# EAGLE design usb-rj45-serial-dongle (EAGLE 9.5.1)
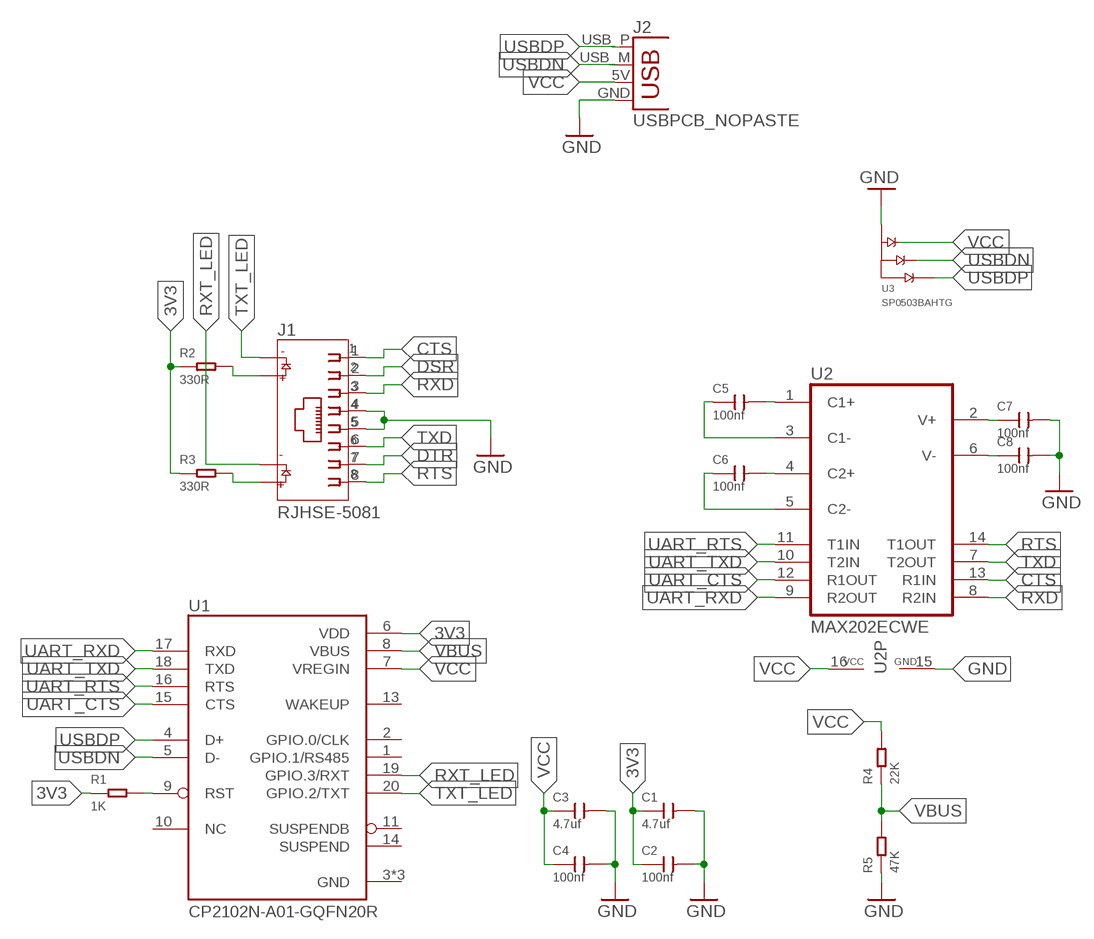
[diagram p0: schematic, sheet 1]

## Parts
C1  4.7uf  CERAMIC-4.7UF-6.3V-20%-X5R(0402)  [C0402]
C2  100nf  CERAMIC-100NF-25V-10%-X7R(0402)  [C0402]
C3  4.7uf  CERAMIC-4.7UF-6.3V-20%-X5R(0402)  [C0402]
C4  100nf  CERAMIC-100NF-25V-10%-X7R(0402)  [C0402]
C5  100nf  CERAMIC-100NF-25V-10%-X7R(0402)  [C0402]
C6  100nf  CERAMIC-100NF-25V-10%-X7R(0402)  [C0402]
C7  100nf  CERAMIC-100NF-25V-10%-X7R(0402)  [C0402]
C8  100nf  CERAMIC-100NF-25V-10%-X7R(0402)  [C0402]
J1  RJHSE-5081  [RJHSE-5081]
J2  USBPCB_NOPASTE  [USB-A-PCB-NOPASTE]
R1  1K  SMD-RES-1K-5%-1/16W(0402)  [R0402]
R2  330R  SMD-RES-330R-1%-1/16W(0402)  [R0402]
R3  330R  SMD-RES-330R-1%-1/16W(0402)  [R0402]
R4  22K  SMD-RES-22R-1%-1/16W(0402)  [R0402]
R5  47K  SMD-RES-47K-5%-1/16W(0402)  [R0402]
U1  CP2102N-A01-GQFN20R  [SILABS_QFN20]
U2  MAX202ECWE  [SO16L]
U3  SP0503BAHTG  [SOT143]

## Nets
3V3 [Supply]: C1.1 C2.1 R1.1 R2.1 R3.1 U1.6(VDD)
CTS: J1.1 U2.13(R1IN)
DSR: J1.2
DTR: J1.7
GND [Supply]: C1.2 C2.2 C3.2 C4.2 C7.2 C8.2 J1.4 J1.5 J2.GND R5.1 U2.15(GND) U3.1(GND)
N$1: C5.2 U2.1(C1+)
N$2: R1.2 U1.9(RST)
N$3: J1.12 R3.2
N$4: C6.2 U2.4(C2+)
N$5: J1.10 R2.2
N$6: C5.1 U2.3(C1-)
N$7: C6.1 U2.5(C2-)
N$8: C7.1 U2.2(V+)
N$9: C8.1 U2.6(V-)
RTS: J1.8 U2.14(T1OUT)
RXD: J1.3 U2.8(R2IN)
RXT_LED: J1.11 U1.19(GPIO.3/RXT)
TXD: J1.6 U2.7(T2OUT)
TXT_LED: J1.9 U1.20(GPIO.2/TXT)
UART_CTS: U1.15(CTS) U2.12(R1OUT)
UART_RTS: U1.16(RTS) U2.11(T1IN)
UART_RXD: U1.17(RXD) U2.9(R2OUT)
UART_TXD: U1.18(TXD) U2.10(T2IN)
USBDN: J2.USB_M(D-) U1.5(D-) U3.3(B)
USBDP: J2.USB_P(D+) U1.4(D+) U3.4(C)
VBUS: R4.1 R5.2 U1.8(VBUS)
VCC: C3.1 C4.1 J2.5V(VBUS) R4.2 U1.7(VREGIN) U2.16(VCC) U3.2(A)
Unconnected: U1.1(GPIO.1/RS485) U1.2(GPIO.0/CLK) U1.10(NC) U1.11(SUSPENDB) U1.13(WAKEUP) U1.14(SUSPEND)

## Power pins joined to a net without a drawn wire
GND: U1.3(GND) U1.12(GND) U1.21(GND)

## Library data of the parts
C1 C3 = OPL_Capacitor:CERAMIC-4.7UF-6.3V-20%-X5R(0402): 302010019; MPN: CC0402MRX5R5BB475
C2 C4-C8 = OPL_Capacitor:CERAMIC-100NF-25V-10%-X7R(0402): 302010024; MPN: CC0402KRX7R8BB104
J1 = RJHSE-5081:RJHSE-5081: connector, mod jack, rt angle pcb, shielded, led1-g, led2-y, single port, rj-45 8 cont; AVAILABILITY: Unavailable; DESCRIPTION: connector, mod jack, rt angle pcb, shielded, led1-g, led2-y, single port, rj-45 8 cont; MF: Amphenol ICC; MP: RJHSE-5381; PACKAGE: None; PRICE: None
J2 = SparkFun-Connectors:USB: USB Connectors USB-B-PTH is fully proven SKU : PRT-00139/CONN-08278 USB-miniB is fully proven SKU : PRT-00587 USB-A-PCB is untested. USB-A-H is throughly reviewed, but untested. Spark Fun Electronics SKU : PRT-00437 USB-B-SMT is throughly reviewed, but untested. Needs silkscreen touching up. USB-A-S has not been used/tested USB-MB-H has not been used/tested USB-MICROB has been used. CONN-09505
R1 = OPL_Resistor:SMD-RES-1K-5%-1/16W(0402): 301012016; MPN: RC0402JR-071KL
R2 R3 = OPL_Resistor:SMD-RES-330R-1%-1/16W(0402): 301011998; MPN: RC0402FR-07330RL
R4 = OPL_Resistor:SMD-RES-22R-1%-1/16W(0402): 301010052; MPN: RC0402FR-0722RL; VALUE: 22R
R5 = OPL_Resistor:SMD-RES-47K-5%-1/16W(0402): 301010005; MPN: RC0402JR-0747KL
U1 = CP2102N-A01-GQFN20R:CP2102N-A01-GQFN20R: Ic Bridge Usb To Uart 20qfn; AVAILABILITY: Unavailable; DESCRIPTION: Ic Bridge Usb To Uart 20qfn; MF: Silicon Labs; MP: CP2102N-A01-GQFN20R; PACKAGE: QFN-20 Silicon Labs; PRICE: None
U2 = maxim:MAX202ECWE: RS232 TRANSCEIVER; MPN: MAX202ECWE+T; OC_FARNELL: 9724419; OC_NEWARK: 67K4364
U3 = littlefuse:SP0503BAHTG

## Net classes
1 Supply: width 0.203 mm

## Board
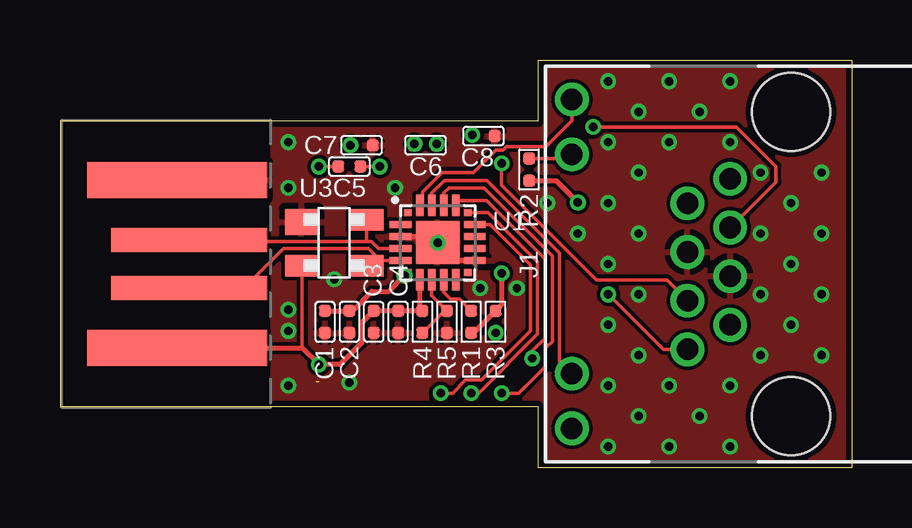
[diagram p1: board, top side]
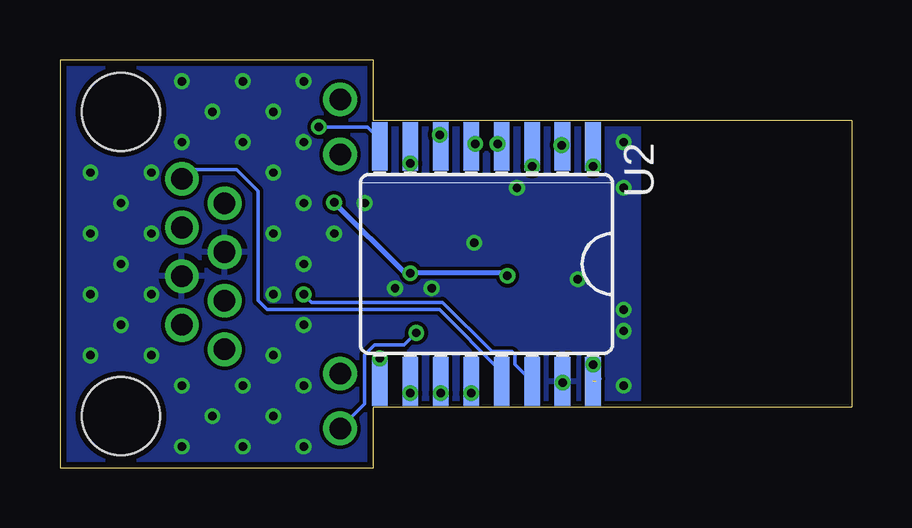
[diagram p2: board, bottom side, seen from below]

Size 33.02 x 17.02 mm. Coordinates in mm from the lower left corner, seen from the top.
Outline: 0,14.48 0,2.54 19.94,2.54 19.94,0 33.02,0 33.02,17.02 19.94,17.02 19.94,14.48 0,14.48
Copper layers (1*16): Top 0.035mm / dielectric 1.5mm / Bottom 0.035mm
Design rules "SeeedStudio_2layer_DRU_no_angle_20140221": minimum track width 6mil, minimum drill 12mil, track to track 6mil, track to pad 6mil, pad to pad 6mil, via to via 6mil, smd to smd 0mil, copper to edge 10mil, drill to drill 10mil, minimum pad ring 10mil, minimum via ring 6mil, stop-mask expansion 2mil, vias tented up to drill 100mil, thermal gap 10mil

### Footprints (pad centres in the part's own frame; a part is rotated, then mirrored left to right if it is on the bottom)
C0402 = smd 0.5 x 0.5: 1 0,0.463; 2 0,-0.463
RJHSE-5081 = drill 0.9: 1 3.55,2.54; 2 2.53,4.32; 3 1.52,2.54; 4 0.5,4.32; 5 -0.51,2.54; 6 -1.53,4.32; 7 -2.54,2.54; 8 -3.56,4.32; 9 6.86,9.14; 10 4.57,9.14; 11 -4.57,9.14; 12 -6.86,9.14 | hole 3.25: 6.35,0; -6.35,0
USB-A-PCB-NOPASTE = smd 7.5 x 1.5: 5V -0.2,-3.5; GND -0.2,3.5 | smd 6.5 x 1: USB_M 0.3,-1; USB_P 0.3,1
R0402 = smd 0.5 x 0.5: 1 0,0.463; 2 0,-0.463
SILABS_QFN20 = smd 0.3 x 0.3: 1 -1.25,1.25; 6 -1.25,-1.25; 11 1.25,-1.25; 16 1.25,1.25 | smd 0.9 x 0.3: 2 -1.55,0.75; 3 -1.55,0.25; 4 -1.55,-0.25; 5 -1.55,-0.75; 12 1.55,-0.75; 13 1.55,-0.25; 14 1.55,0.25; 15 1.55,0.75 | smd 0.3 x 0.9: 7 -0.75,-1.55; 8 -0.25,-1.55; 9 0.25,-1.55; 10 0.75,-1.55; 17 0.75,1.55; 18 0.25,1.55; 19 -0.25,1.55; 20 -0.75,1.55 | smd 1.8 x 1.8: 21 0,0
SO16L = smd 0.66 x 2.032: 1 -4.445,-4.902; 2 -3.175,-4.902; 3 -1.905,-4.902; 4 -0.635,-4.902; 5 0.635,-4.902; 6 1.905,-4.902; 7 3.175,-4.902; 8 4.445,-4.902; 9 4.445,4.902; 10 3.175,4.902; 11 1.905,4.902; 12 0.635,4.902; 13 -0.635,4.902; 14 -1.905,4.902; 15 -3.175,4.902; 16 -4.445,4.902
SOT143 = smd 1.4 x 1.1: 1 -1.35,0.86 | smd 1.4 x 0.9: 2 -1.35,-0.96; 3 1.35,-0.96; 4 1.35,0.96

### Placement (x,y rotation side)
C1  11.05,6.1 0 top
C2  12.06,6.1 0 top
C3  13.08,6.1 0 top
C4  14.1,6.1 0 top
C5  12.06,12.57 270 top
C6  15.24,13.46 270 top
C7  12.57,13.46 90 top
C8  17.65,13.84 90 top
J1  30.48,8.51 90 top
J2  5.08,8.51 0 top
R1  17.14,6.1 180 top
R2  19.56,12.45 180 top
R3  18.16,6.1 0 top
R4  15.11,6.1 180 top
R5  16.13,6.1 180 top
U1  15.75,9.4 0 top
U2  15.24,8.51 180 bottom
U3  11.43,9.4 0 top

### Tracks (layer width: path | path; a pad name or v marks a point on that pad's centre or on a via)
3V3  (via drill 0.35)
  Top 0.203: R2.1 20.68,11.98 v21.59,11.07 | C1.1 C2.1 12.19,6.56 13,7.37 13.72,7.37 v14.37,8.02 U1.6 | v18.41,8.13 18.41,6.81 R3.1 17.24,5.63 R1.1
  Bottom 0.203: 18.4,8.14 U1.6 v14.37,8.02 | 18.4,8.14 18.66,8.14 v21.59,11.07 | v18.41,8.13 18.4,8.14
CTS
  Bottom 0.152: 14.61,4.06 U2.13 14.61,4.01 17.2,6.6 24.38,6.6 24.77,6.98 24.77,11.56 25.65,12.44 27.56,12.44 J1.1
GND  (via drill 0.35)
  Top 0.203: U1.3 15.5,9.65 U1.21 16.5,8.65 U1.12
  other vias: 15.75,9.4 22.86,0.89 29.21,12.32 29.21,9.78 29.21,7.24 31.75,9.78 29.21,4.7 30.48,11.05 30.48,5.97 30.48,8.51 31.75,7.24 31.75,4.7 27.94,3.43 31.75,12.32 26.67,2.16 27.94,0.89 25.4,0.89 25.4,3.43 24.13,2.16 24.13,4.7 27.94,13.59 26.67,14.86 25.4,13.59 25.4,16.13 24.13,14.86 27.94,16.13 22.86,16.13 22.86,3.43 22.86,13.59 24.13,12.32 22.86,11.05 24.13,7.24 9.53,13.59 9.53,11.68 9.53,3.43 9.53,5.71 9.53,6.6 13.97,11.68 24.13,9.78 22.86,8.51 21.59,9.78 22.86,5.97 20.32,11.05 17.53,7.49 19.05,7.49 12.06,3.56 11.43,7.87
  pour Top: 8.89,14.48 19.94,14.48 19.94,17.02 33.02,17.02 33.02,0 19.94,0 19.94,2.54 8.89,2.54 8.88,11.56 1.4,11.56 1.4,12.57 8.89,12.57
  pour Bottom: 8.89,2.54 8.89,14.48 19.94,14.48 19.94,17.02 33.02,17.02 33.02,0 19.94,0 19.94,2.54
N$1  (via drill 0.35)
  Top 0.152: C5.2 v10.79,12.57
  Bottom 0.152: v10.79,12.57 U2.1
N$2
  Top 0.152: U1.9 16,7.34 16.29,7.05 16.65,7.05 R1.2
N$3  (via drill 0.35)
  Bottom 0.152: R3.2 18.67,5.13 19.91,5.13 20.32,4.72 20.32,2.67 J1.12
  other vias: 18.16,5.63
N$4  (via drill 0.35)
  Top 0.152: v14.78,13.52 C6.2
  Bottom 0.152: U2.4 14.67,13.41 v14.78,13.52
N$5
  Top 0.152: J1.10 21.17,12.91 R2.2
N$6  (via drill 0.35)
  Top 0.152: v13.34,12.57 C5.1
  Bottom 0.152: v13.34,12.57 U2.3
N$7  (via drill 0.35)
  Top 0.152: v15.7,13.52 C6.1
  Bottom 0.152: U2.5 15.77,13.52 v15.7,13.52
N$8  (via drill 0.35)
  Bottom 0.152: C7.1 U2.2
  other vias: 12.11,13.46
N$9  (via drill 0.35)
  Top 0.152: v17.19,13.9 C8.1
  Bottom 0.152: 17.23,13.49 U2.6 17.14,13.85 v17.19,13.9
RTS  (via drill 0.35)
  Top 0.152: J1.8 25.15,4.95 v22.86,7.24
  Bottom 0.152: v22.86,7.24 22.53,6.91 17.08,6.91 15.02,4.85 14.18,4.85 14.05,4.72 14.05,4.32 U2.14
RXD  (via drill 0.35)
  Top 0.152: J1.3 29.84,11.93 29.84,12.57 28.19,14.22 v22.23,14.22
  Bottom 0.152: 19.68,14.15 19.68,13.72 | 19.68,13.72 U2.8 | v22.23,14.22 20.19,14.22 19.68,13.72
RXT_LED
  Top 0.152: J1.11 20.83,4.45 20.83,8.96 17.8,11.99 16.02,11.99 15.5,11.46 U1.19
TXD  (via drill 0.35)
  Top 0.152: v18.41,12.7 18.41,11.81 22.37,7.85 25.3,7.85 J1.6
  Bottom 0.152: v18.41,12.7 U2.7
TXT_LED
  Top 0.152: U1.20 15.12,11.07 15.12,11.52 15.92,12.32 17.25,12.32 18.18,13.26 18.46,13.26 18.61,13.4 20.26,13.4 | 20.26,13.4 21.34,14.48 J1.9 | 20.26,13.4 20.25,13.39
UART_CTS  (via drill 0.35)
  Top 0.152: U1.15 17.92,10.15 19.61,8.46 19.61,5.71 17.57,3.68 16.91,3.68 16.36,3.12 v15.88,3.12
  Bottom 0.152: v15.88,3.12 U2.12
UART_RTS  (via drill 0.35)
  Top 0.152: U1.16 17.84,10.65 19.91,8.58 19.91,5.59 17.45,3.12 v17.14,3.12
  Bottom 0.152: v17.14,3.12 U2.11
UART_RXD  (via drill 0.35)
  Top 0.152: U1.17 16.5,11.15 17.78,11.15 20.22,8.71 20.22,5.41 19.68,4.88 v19.68,4.57
  Bottom 0.152: 19.68,4.19 U2.9 v19.68,4.57
UART_TXD  (via drill 0.35)
  Top 0.152: U1.18 16,11.46 16.23,11.68 17.68,11.68 20.52,8.84 20.52,5.28 20.24,5 20.24,4.24 19.12,3.12 v18.41,3.12
  Bottom 0.152: v18.41,3.12 U2.10
USBDN
  Top 0.152: U1.5 13.34,8.65 | 5.49,7.62 J2.USB_M 7.68,7.51 9.31,9.14 12.86,9.14 13.34,8.67 13.34,8.65 | U3.3 12.78,8.65 13.34,8.65
USBDP
  Top 0.152: U1.4 13.28,9.15 12.98,9.45 12.78,9.45 | J2.USB_P 8.24,9.51 8.3,9.45 12.78,9.45 | 12.78,9.45 U3.4
VBUS
  Top 0.152: U1.8 15.5,7.19 R5.2 16.04,6.56 R4.1
VCC  (via drill 0.35)  (1 unrouted)
  Top 0.152: U3.2 10.1,8.44 10.1,5.01
  Top 0.203: J2.5V 10.1,5.01 v10.79,4.32 11.68,4.32 12.57,5.21 12.57,6.05 C3.1 C4.1 R4.2 14.99,6.56 15,6.57 U1.7 15,7.65
  Bottom 0.203: 10.67,3.61 10.54,3.73 10.79,3.99 v10.79,4.32